# EAGLE design ProtoSnap-Pro_Mini (EAGLE 6.5.0)

## Sheet 1 of 2
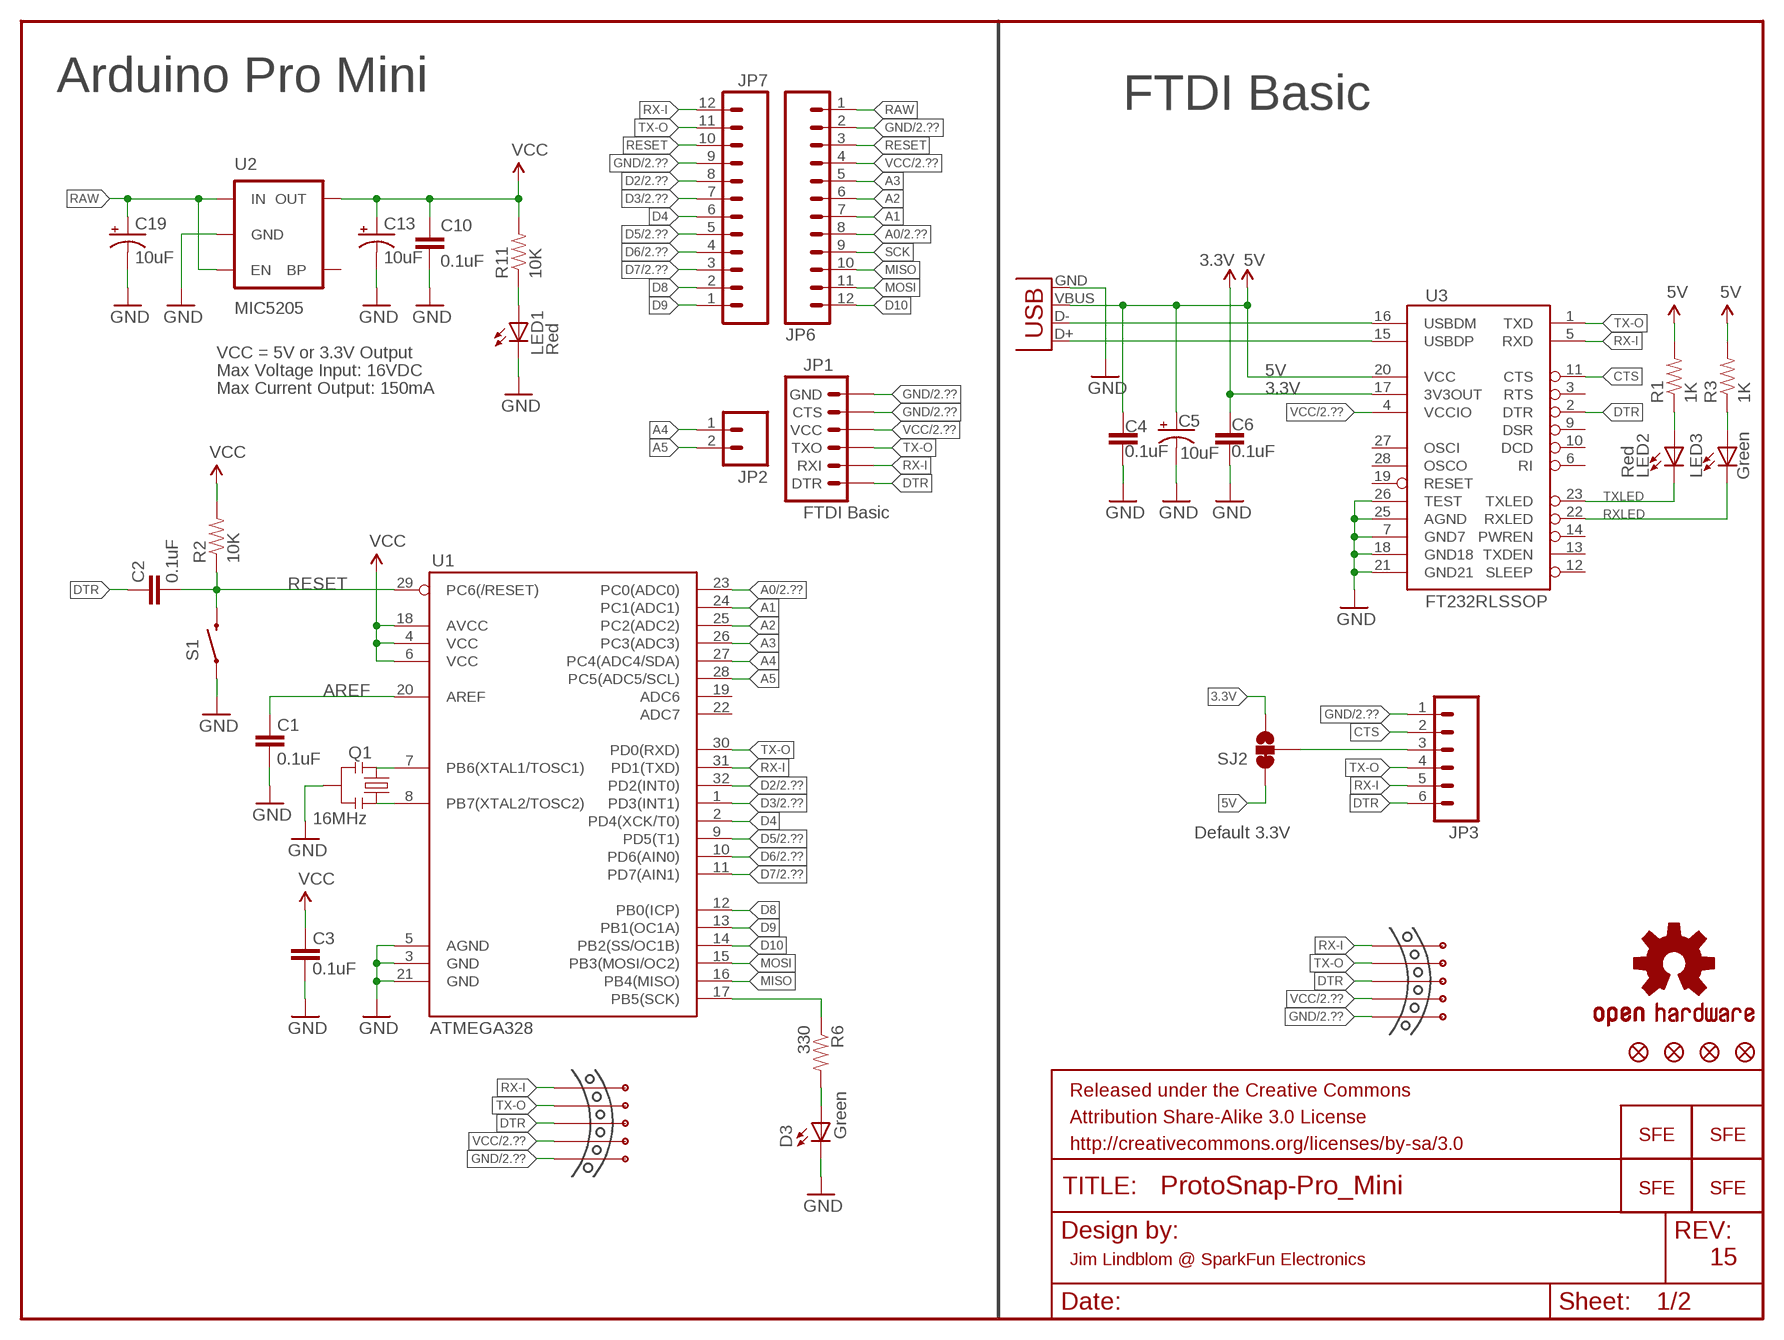
[diagram p0: schematic, sheet 1]

### Parts
C1  0.1uF  CAP0603-CAP  [0603-CAP]
C2  0.1uF  CAP0603-CAP  [0603-CAP]
C3  0.1uF  CAP0603-CAP  [0603-CAP]
C4  0.1uF  CAP0603-CAP  [0603-CAP]
C5  10uF  CAP_POL1206  [EIA3216]
C6  0.1uF  CAP0603-CAP  [0603-CAP]
C10  0.1uF  CAP0603-CAP  [0603-CAP]
C13  10uF  CAP_POL1206  [EIA3216]
C19  10uF  CAP_POL1206  [EIA3216]
D3  Green  LEDLED-ALT1  [0603-LED-ALT1]
FRAME1  FRAME-LETTER  [CREATIVE_COMMONS]
JP1  FTDI Basic  ARDUINO_SERIAL_PROGRAMPTH  [1X06]
JP2  M02PTH  [1X02]
JP3  M06SIP  [1X06]
JP4  LOGO-SFENW2  [SFE-NEW-WEB]
JP6  M12PTH  [1X12]
JP7  M12PTH  [1X12]
JP15  LOGO-SFESK  [SFE-LOGO-FLAME]
JP16  FIDUCIAL1X2.5  [FIDUCIAL-1X2.5]
JP17  LOGO-SFESK  [SFE-LOGO-FLAME]
JP18  LOGO-SFENEW  [SFE-NEW-WEBLOGO]
JP19  FIDUCIAL1X2.5  [FIDUCIAL-1X2.5]
JP20  FIDUCIAL1X2.5  [FIDUCIAL-1X2.5]
JP22  FIDUCIAL1X2.5  [FIDUCIAL-1X2.5]
LED1  Red  LEDLED-ALT1  [0603-LED-ALT1]
LED2  Red  LEDLED-ALT1  [0603-LED-ALT1]
LED3  Green  LEDLED-ALT1  [0603-LED-ALT1]
LOGO1  OSHW-LOGOS  [OSHW-LOGO-S]
Q1  16MHz  RESONATOR1:1  [RESONATOR-SMD-1:1]
R1  1K  RESISTOR0603-RES  [0603-RES]
R2  10K  RESISTOR0603-RES  [0603-RES]
R3  1K  RESISTOR0603-RES  [0603-RES]
R6  330  RESISTOR0603-RES  [0603-RES]
R11  10K  RESISTOR0603-RES  [0603-RES]
S1  SWITCH-MOMENTARY-2SMD-ALT01  [TACTILE-SWITCH-SMD-ALT01]
SJ2  SOLDERJUMPER_2WAYS  [SJ_3]
U1  ATMEGA328  ATMEGA168  [TQFP32-08]
U2  MIC5205  V_REG_LDOSMD  [SOT23-5]
U3  FT232RLSSOP  [SSOP28DB]
U$22  MOUSE-BITE-5  [MOUSE-BITE-5]
U$23  MOUSE-BITE-5  [MOUSE-BITE-5]
X2  USB-SMD-NS  [USB-MINIB-NOSTOP]

### Nets
3.3V [power]: C6.1 SJ2.3 U3.17(3V3OUT)
5V: C4.1 C5.A(+) R1.2 R3.2 SJ2.1 U3.20(VCC) X2.VBUS
A0: JP6.8 U1.23(PC0(ADC0)) ; also sheet 2
A1: JP6.7 U1.24(PC1(ADC1))
A2: JP6.6 U1.25(PC2(ADC2))
A3: JP6.5 U1.26(PC3(ADC3))
A4: JP2.1 U1.27(PC4(ADC4/SDA))
A5: JP2.2 U1.28(PC5(ADC5/SCL))
AREF: C1.2 U1.20(AREF)
CTS: JP3.2 U3.11(CTS)
D2: JP7.8 U1.32(PD2(INT0)) ; also sheet 2
D3: JP7.7 U1.1(PD3(INT1)) ; also sheet 2
D4: JP7.6 U1.2(PD4(XCK/T0))
D5: JP7.5 U1.9(PD5(T1)) ; also sheet 2
D6: JP7.4 U1.10(PD6(AIN0)) ; also sheet 2
D7: JP7.3 U1.11(PD7(AIN1)) ; also sheet 2
D8: JP7.2 U1.12(PB0(ICP))
D9: JP7.1 U1.13(PB1(OC1A))
D10: JP6.12 U1.14(PB2(SS/OC1B))
DTR: C2.2 JP1.1(DTR) JP3.6 U3.2(DTR) U$22.P$3 U$23.P$3
GND [power]: C1.1 C3.1 C4.2 C5.C(-) C6.2 C10.2 C13.C(-) C19.C(-) D3.C JP1.5(CTS) JP1.6(GND) JP3.1 JP6.2 JP7.9 LED1.C Q1.2 S1.1 S1.2 U1.3(GND) U1.5(AGND) U1.21(GND) U2.2(GND) U3.7(GND7) U3.18(GND18) U3.21(GND21) U3.25(AGND) U3.26(TEST) U$22.P$5 U$23.P$5 X2.GND ; also sheet 2
MISO: JP6.10 U1.16(PB4(MISO))
MOSI: JP6.11 U1.15(PB3(MOSI/OC2))
N$1: Q1.1 U1.8(PB7(XTAL2/TOSC2))
N$2: Q1.3 U1.7(PB6(XTAL1/TOSC1))
N$3: LED2.A R1.1
N$4: LED3.A R3.1
N$7: D3.A R6.2
N$38: LED1.A R11.1
RAW [power]: C19.A(+) JP6.1 U2.1(IN) U2.3(EN)
RESET: C2.1 JP6.3 JP7.10 R2.1 S1.3 S1.4 U1.29(PC6(/RESET))
RX-I: JP1.2(RXI) JP3.5 JP7.12 U1.31(PD1(TXD)) U3.5(RXD) U$22.P$1 U$23.P$1
RXLED: LED3.C U3.22(RXLED)
SCK: JP6.9 R6.1 U1.17(PB5(SCK))
TX-O: JP1.3(TXO) JP3.4 JP7.11 U1.30(PD0(RXD)) U3.1(TXD) U$22.P$2 U$23.P$2
TXLED: LED2.C U3.23(TXLED)
USB_D+: U3.15(USBDP) X2.D+
USB_D-: U3.16(USBDM) X2.D-
VCC: C3.2 C10.1 C13.A(+) JP1.4(VCC) JP3.3 JP6.4 R2.2 R11.2 SJ2.2 U1.4(VCC) U1.6(VCC) U1.18(AVCC) U2.5(OUT) U3.4(VCCIO) U$22.P$4 U$23.P$4 ; also sheet 2
Unconnected: U1.19(ADC6) U1.22(ADC7) U2.4(BP) U3.3(RTS) U3.6(RI) U3.9(DSR) U3.10(DCD) U3.12(SLEEP) U3.13(TXDEN) U3.14(PWREN) U3.19(RESET) U3.27(OSCI) U3.28(OSCO)

### Notes on the sheet
- Arduino Pro Mini
- FTDI Basic
- VCC = 5V or 3.3V Output
- Max Voltage Input: 16VDC
- Max Current Output: 150mA
- Default 3.3V
- Jim Lindblom @ SparkFun Electronics | 15

## Sheet 2 of 2
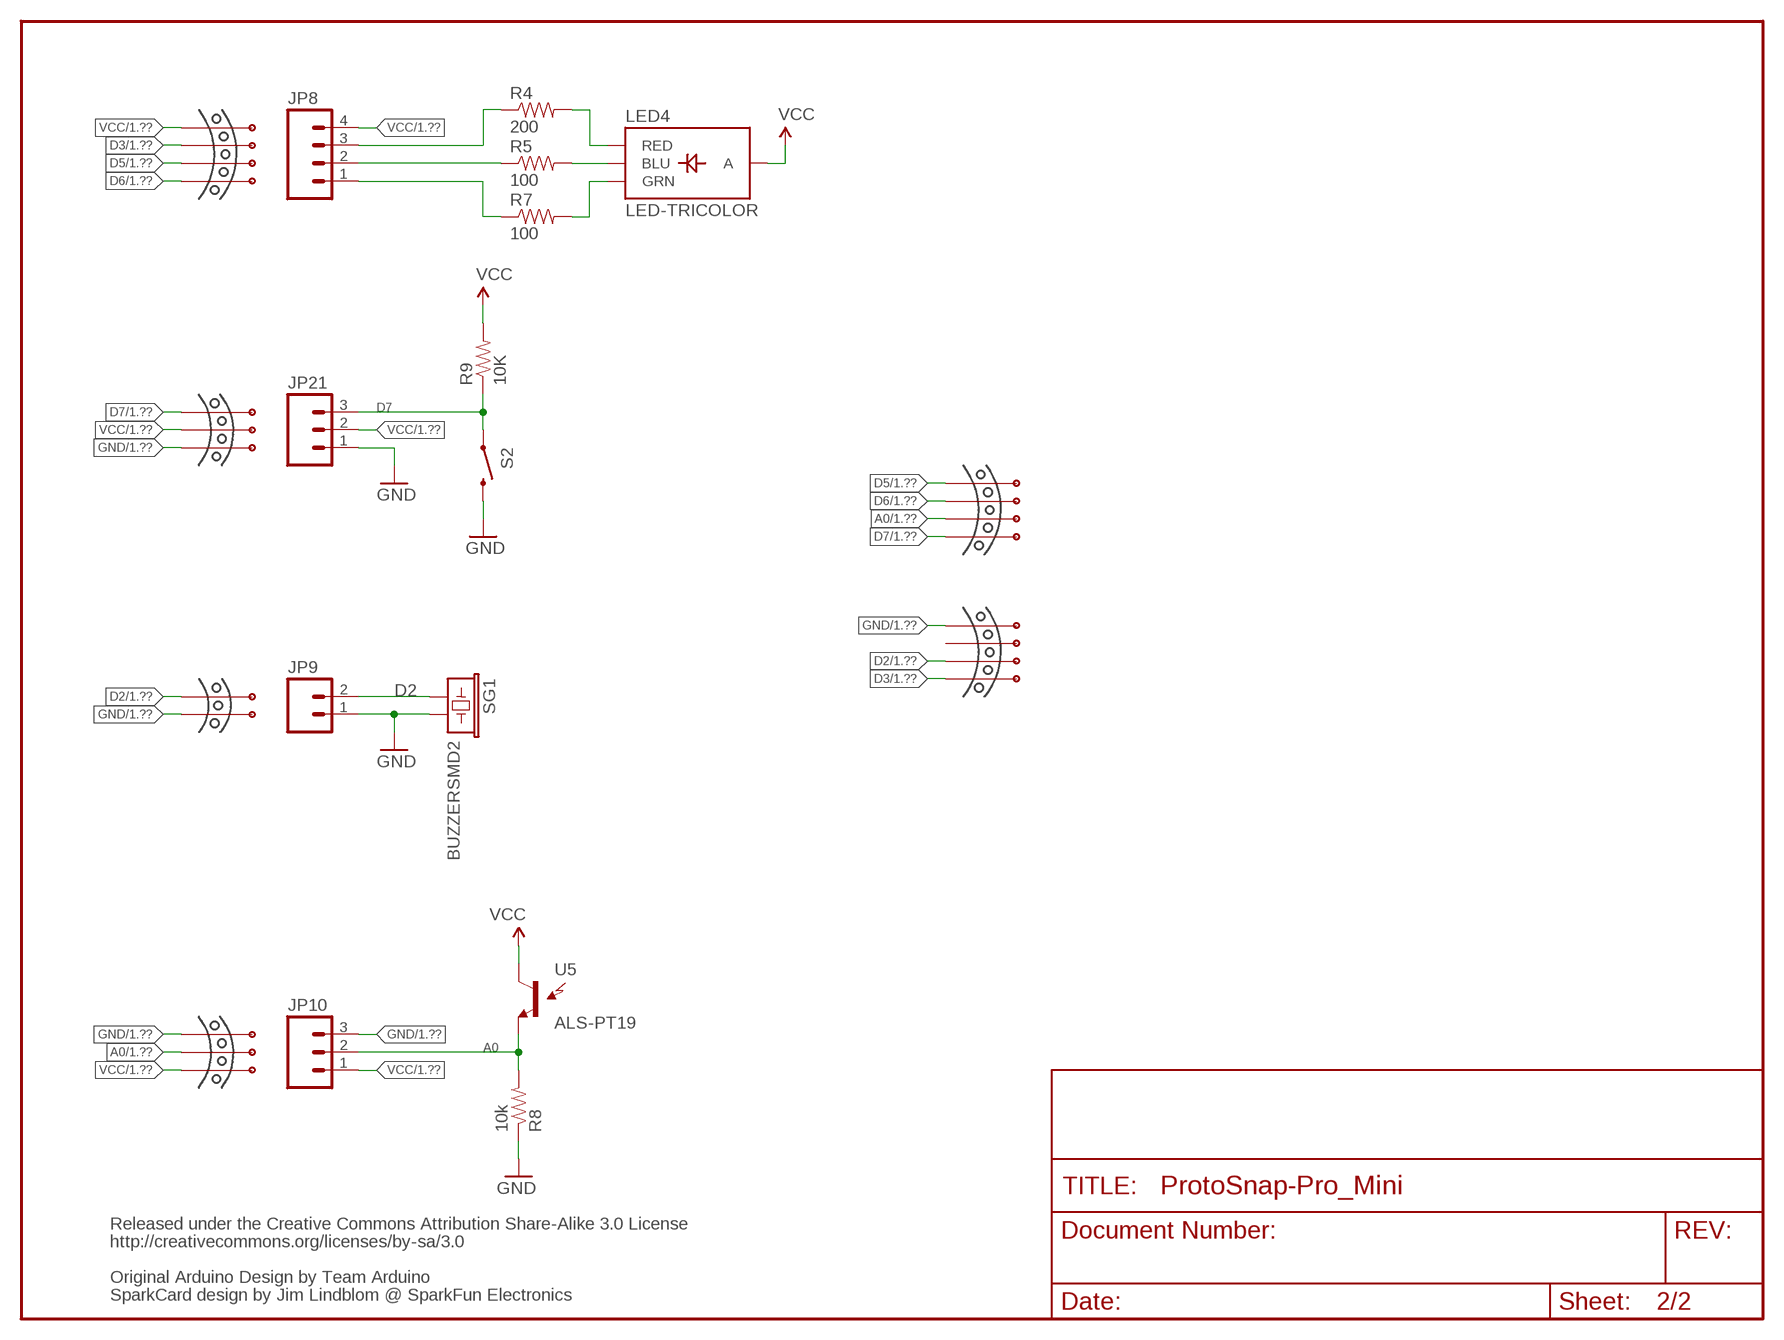
[diagram p1: schematic, sheet 2]

### Parts
JP8  M04PTH  [1X04]
JP9  M02PTH  [1X02]
JP10  M03PTH  [1X03]
JP21  M03PTH  [1X03]
LED4  LED-TRICOLOR  [LED-TRICOLOR-SMD]
R4  200  RESISTOR0603-RES  [0603-RES]
R5  100  RESISTOR0603-RES  [0603-RES]
R7  100  RESISTOR0603-RES  [0603-RES]
R8  10k  RESISTOR0603-RES  [0603-RES]
R9  10K  RESISTOR0603-RES  [0603-RES]
S2  SWITCH-MOMENTARY-2SMD-ALT01  [TACTILE-SWITCH-SMD-ALT01]
SG1  BUZZERSMD2  [BUZZER-CCV]
U5  ALS-PT19  LIGHTSENSORALS  [ALS-PT19]
U$2  MOUSE-BITE-3  [MOUSE-BITE-3]
U$7  MOUSE-BITE-2  [MOUSE-BITE-2]
U$8  MOUSE-BITE-4  [MOUSE-BITE-4]
U$9  MOUSE-BITE-3  [MOUSE-BITE-3]
U$13  MOUSE-BITE-4  [MOUSE-BITE-4]
U$14  MOUSE-BITE-4  [MOUSE-BITE-4]

### Nets
A0: JP10.2 R8.2 U5.E(E1) U$9.P$2 U$13.P$3 ; also sheet 1
D2: JP9.2 SG1.+ U$7.P$1 U$14.P$3 ; also sheet 1
D3: JP8.3 R4.1 U$8.P$2 U$14.P$4 ; also sheet 1
D5: JP8.1 R7.1 U$8.P$3 U$13.P$1 ; also sheet 1
D6: JP8.2 R5.1 U$8.P$4 U$13.P$2 ; also sheet 1
D7: JP21.3 R9.1 S2.1 S2.2 U$2.P$3 U$13.P$4 ; also sheet 1
GND [power]: JP9.1 JP10.3 JP21.1 R8.1 S2.3 S2.4 SG1.- U$2.P$1 U$7.P$2 U$9.P$3 U$14.P$1 ; also sheet 1
N$6: LED4.R(RED) R4.2
N$8: LED4.B(BLU) R5.2
N$9: LED4.G(GRN) R7.2
VCC: JP8.4 JP10.1 JP21.2 LED4.A R9.2 U5.C(C1) U$2.P$2 U$8.P$1 U$9.P$1 ; also sheet 1
Unconnected: U$14.P$2

### Notes on the sheet
- Released under the Creative Commons Attribution Share-Alike 3.0 License
- http://creativecommons.org/licenses/by-sa/3.0
- Original Arduino Design by Team Arduino
- SparkCard design by Jim Lindblom @ SparkFun Electronics

## Library data of the parts
C1-C4 C6 C10 = SparkFun:CAP: Capacitor Standard 0603 ceramic capacitor, and 0.1" leaded capacitor.
C5 C13 C19 = SparkFun:CAP_POL: Capacitor Polarized These are standard SMD and PTH capacitors. Normally 10uF, 47uF, and 100uF in electrolytic and tantalum varieties. Always verify the external diameter of the through hole cap, it varies with capacity, voltage, and manufacturer. The EIA devices should be standard.
D3 LED1-LED3 = Testing:LED: LEDs Standard schematic elements and footprints for 5mm, 3mm, 1206, and 0603 sized LEDs. 5mm - Spark Fun Electronics SKU : COM-00529 (and others)
FRAME1 = SparkFun-Aesthetics:FRAME-LETTER: Schematic Frame Standard 8.5x11 US Letter frame
JP1 = SparkFun:ARDUINO_SERIAL_PROGRAM
JP2 JP9 = SparkFun:M02: Header 2 Standard 2-pin 0.1" header. Use with straight break away headers (SKU : PRT-00116), right angle break away headers (PRT-00553), swiss pins (PRT-00743), machine pins (PRT-00117), and female headers (PRT-00115). Molex polarized connector foot print use with SKU : PRT-08233 with associated crimp pins and housings.
JP3 = SparkFun:M06: Header 6 Standard 6-pin 0.1" header. Use with straight break away headers (SKU : PRT-00116), right angle break away headers (PRT-00553), swiss pins (PRT-00743), machine pins (PRT-00117), and female headers (PRT-00115). Molex polarized connector foot print use with SKU : PRT-08094 with associated crimp pins and housings. NOTES ON THE VARIANTS LOCK and LOCK_LONGPADS... This footprint was designed to help hold the alignment of a through-hole component (i.e. 6-pin header) while soldering it into place. You may notice that each hole has been shifted either up or down by 0.005 of an inch from it's more standard position (which is a perfectly straight line). This slight alteration caused the pins (the squares in the middle) to touch the edges of the holes. Because they are alternating, it causes a "brace" to hold the component in place. 0.005 has proven to be the perfect amount of "off-center" position when using our standard breakaway headers. Although looks a little odd when you look at the bare footprint, once you have a header in there, the alteration is very hard to notice. Also, if you push a header all the way into place, it is covered up entirely on the bottom side. This idea of altering the position of holes to aid alignment will be further integrated into the Sparkfun Library for other footprints. It can help hold any component with 3 or more connection pins.
JP4 JP15 JP17 JP18 = SparkFun:LOGO-SFE: Spark Fun Electronics PCB Logo This is the standard Spark Fun Electronics PCB logo.
JP6 JP7 = SparkFun:M12: Header 12 Standard 12-pin 0.1" header. Use with straight break away headers (SKU : PRT-00116), right angle break away headers (PRT-00553), swiss pins (PRT-00743), machine pins (PRT-00117), and female headers (PRT-00115).
JP8 = SparkFun:M04: Header 4 Standard 4-pin 0.1" header. Use with straight break away headers (SKU : PRT-00116), right angle break away headers (PRT-00553), swiss pins (PRT-00743), machine pins (PRT-00117), and female headers (PRT-00115). Molex polarized connector foot print use with SKU : PRT-08231 with associated crimp pins and housings. 1MM SMD Version SKU: PRT-10208
JP10 JP21 = SparkFun:M03: Header 3 Standard 3-pin 0.1" header. Use with straight break away headers (SKU : PRT-00116), right angle break away headers (PRT-00553), swiss pins (PRT-00743), machine pins (PRT-00117), and female headers (PRT-00115). Molex polarized connector foot print use with SKU : PRT-08232 with associated crimp pins and housings.
JP16 JP19 JP20 JP22 = abes:FIDUCIAL: Fiducial Alignment Points Various fiducial points for machine vision alignment.
LED4 = SparkFun:LED-TRICOLOR: Tri-Color LED SMD Proven layout and schematic for triple color LED in SMD package - common anode. Spark Fun Electronics SKU : COM-07844
LOGO1 = SparkFun-Aesthetics:OSHW-LOGO: Open Source Hardware Logo This logo indicates the piece of hardware it is found on incorporates a OSHW license and/or adheres to the definition of open source hardware found here: http://freedomdefined.org/OSHW
Q1 = Testing:RESONATOR: Resonator Small SMD resonator. This is the itty bitty 10/20MHz resonators with built in caps. CSTCE10M0G55 and CSTCE20M0V53. Footprint for SMD has been used in SFE production for years, and does work okay. 1:1 is an attempt to get larger fillets on the sides so it will be easier to inspect these solders in our AOI machine. The pads have been minimized to match the actual metal under the resonator. To see this relation, it includes an image import of the bottom side of the component. Imported to scale on layer 200.
R1-R9 R11 = SparkFun:RESISTOR: Resistor Basic schematic elements and footprints for 0603, 1206, and PTH resistors.
S1 S2 = Testing:SWITCH-MOMENTARY-2: Various NO switches- pushbuttons, reed, etc
SG1 = SparkFun:BUZZER: Buzzer 12mm Spark Fun Electronics SKU : Comp-Buzzer
SJ2 = SparkFun:SOLDERJUMPER_2WAY: Solder Jumper 2 way solder jumper
U1 = SparkFun:ATMEGA168
U2 = SparkFun:V_REG_LDO: Voltage Regulator LDO Standard 150mA LDO voltage regulator in SOT-23 layout. Micrel part MIC5205. BP (by-pass) pin is used to lower output noise with 470pF cap.
U3 = SparkFun:FT232RL: USB UART FT232RL 4th Generation USB UART (USB <-> Serial) Controller. Spark Fun Electronics SKU : COM-00650
U5 = SparkFun-Sensors:LIGHTSENSOR: Ambient Light Sensor Simple light detection sensor. Output varies with light intensity input. Spark Fun Electronics SKU : COM-08348; PROD_ID: IC-11836
U$2 U$9 = SparkFun:MOUSE-BITE-3
U$7 = SparkFun:MOUSE-BITE-2
U$8 U$13 U$14 = SparkFun:MOUSE-BITE-4
U$22 U$23 = SparkFun:MOUSE-BITE-5
X2 = SparkFun:USB: USB Connectors USB-B-PTH is fully proven SKU : PRT-00139 USB-miniB is fully proven SKU : PRT-00587 USB-A-PCB is untested. USB-A-H is throughly reviewed, but untested. Spark Fun Electronics SKU : PRT-00437 USB-B-SMT is throughly reviewed, but untested. Needs silkscreen touching up. USB-A-S has not been used/tested USB-MB-H has not been used/tested

## Net classes
0 default: width 0.203 mm
1 power: width 0.254 mm

## Board
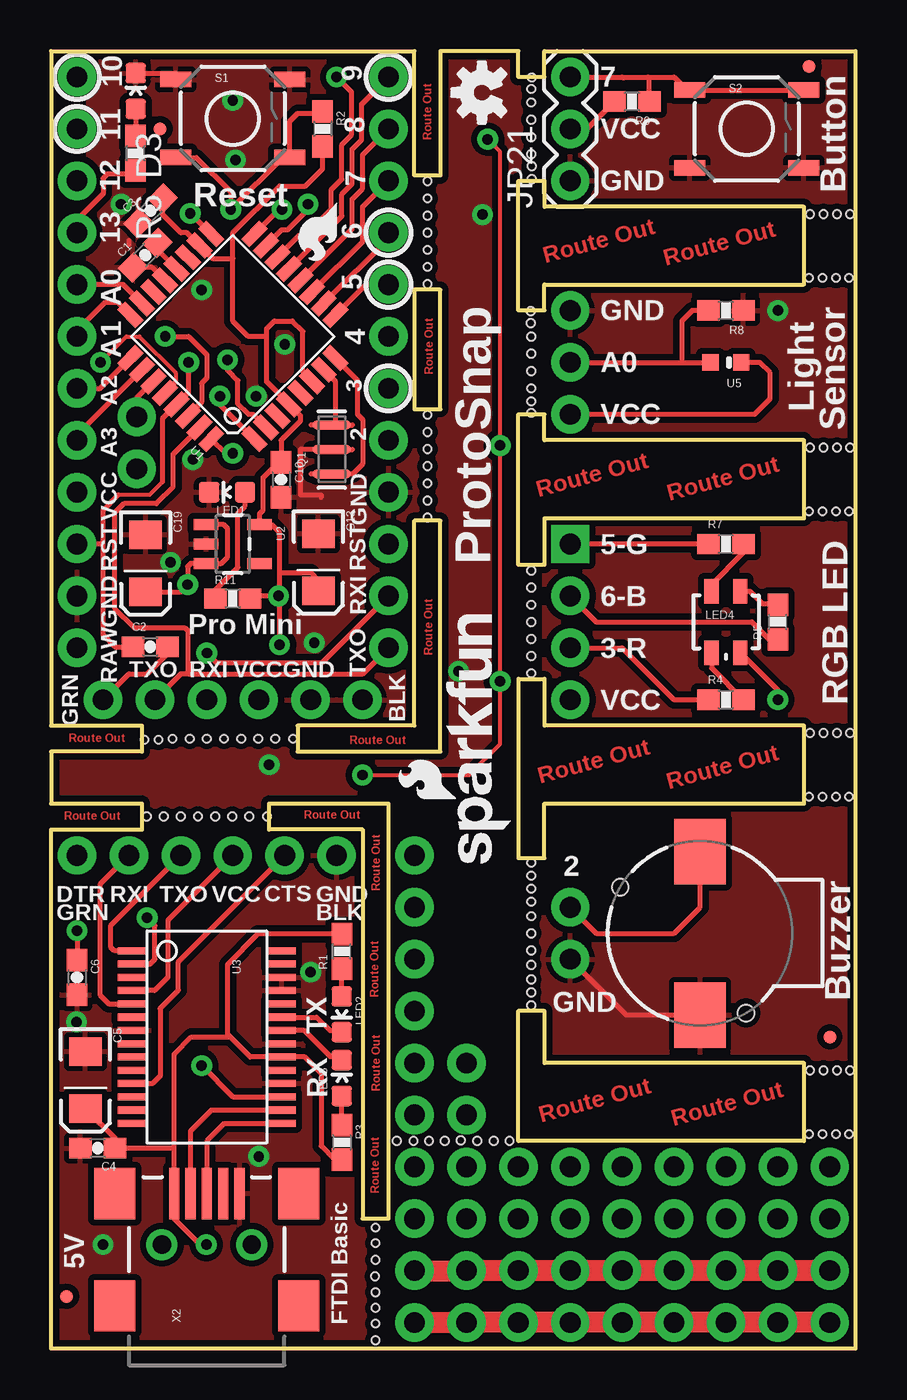
[diagram p2: board, top side]
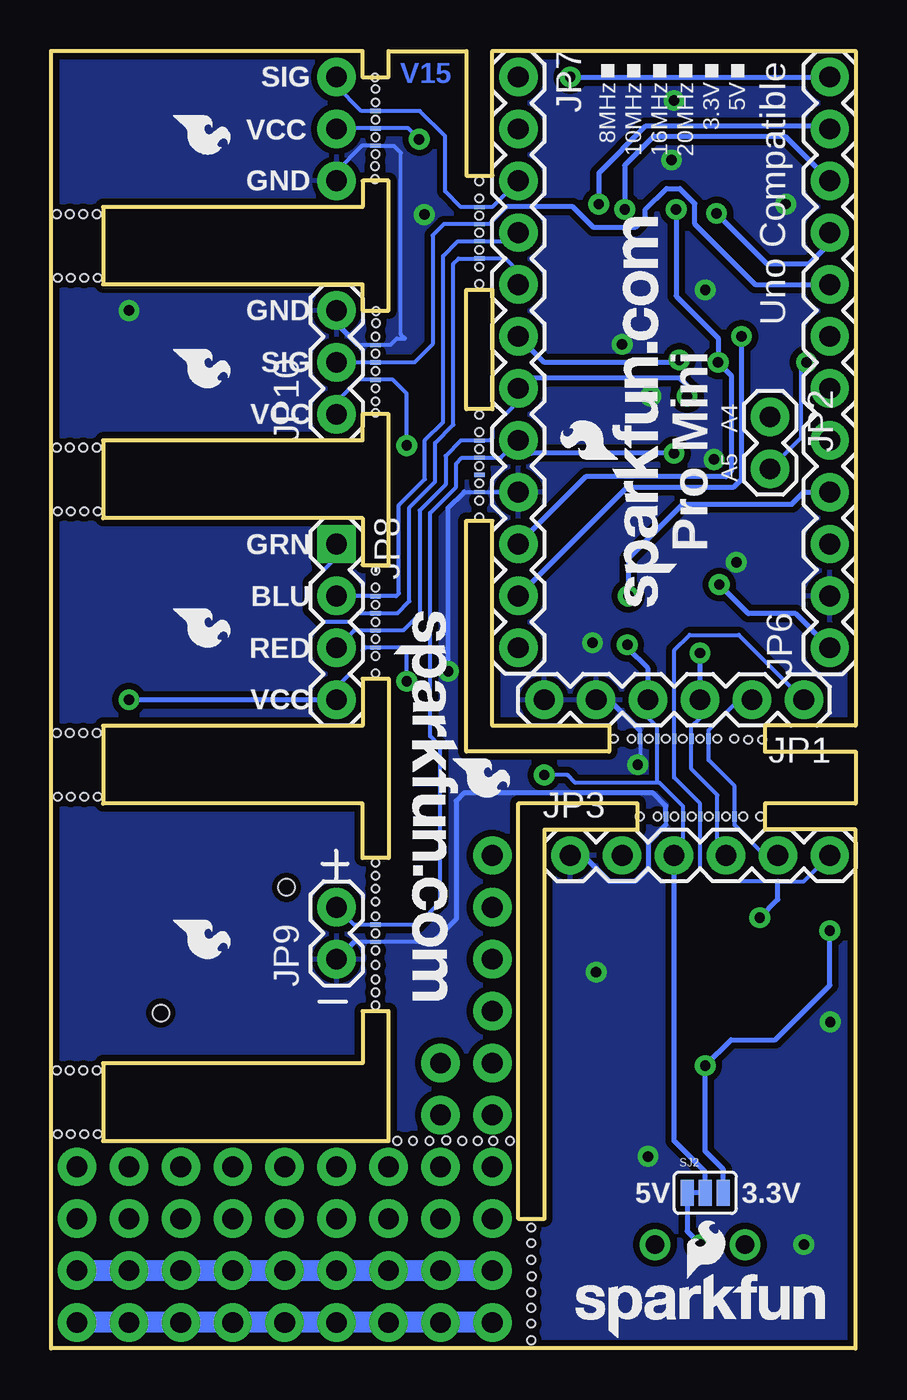
[diagram p3: board, bottom side, seen from below]

Size 39.37 x 63.5 mm. Coordinates in mm from the lower left corner, seen from the top.
Outline: 36.83,13.97 24.13,13.97 24.13,16.51 22.86,16.51 22.86,10.16 36.83,10.16 36.83,13.97
Outline: 24.13,26.67 36.83,26.67 36.83,30.48 24.13,30.48 24.13,32.77 22.86,32.77 22.86,24 24.13,24 24.13,26.67
Outline: 24.13,40.64 36.83,40.64 36.83,44.45 24.13,44.45 24.13,45.72 22.86,45.72 22.86,38.35 24.13,38.35 24.13,40.64
Outline: 36.83,55.88 24.13,55.88 24.13,57.15 22.86,57.15 22.86,50.8 24.13,50.8 24.13,52.07 36.83,52.07 36.83,55.88
Outline: 24.13,63.5 39.37,63.5 39.37,0 0,0 0,25.4 4.45,25.4 4.45,26.67 0,26.67 0,29.21 4.45,29.21 4.45,30.48 0,30.48 0,63.5 17.78,63.5 17.78,57.4 19.05,57.4 19.05,63.5 22.86,63.5 22.86,62.23 24.13,62.23 24.13,63.5
Outline: 17.78,30.48 17.78,40.51 19.05,40.51 19.05,29.21 12.06,29.21 12.06,30.48 17.78,30.48
Outline: 15.24,25.4 15.24,6.35 16.51,6.35 16.51,26.67 10.67,26.67 10.67,25.4 15.24,25.4
Outline: 17.78,45.97 19.05,45.97 19.05,51.82 17.78,51.82 17.78,45.97
Copper layers (1*16): Top 0.035mm / dielectric 1.5mm / Bottom 0.035mm
Design rules "SparkFun *": minimum track width 8mil, minimum drill 20mil, track to track 8mil, track to pad 8mil, pad to pad 8mil, via to via 8mil, smd to smd 8mil, copper to edge 8mil, drill to drill 8mil, minimum pad ring 12mil, minimum via ring 10mil, stop-mask expansion 4mil, vias tented up to drill 20mil, thermal gap 10mil
Holes 0.38 mm at 19.25,10.16 20.85,10.16 21.67,10.16 20.04,10.19 22.43,10.16 5.26,29.79 4.57,29.79 16.92,10.16 17.73,10.16 18.49,10.16 15.88,2.74 15.88,4.34 15.88,5.16 15.85,3.53 15.88,5.92 15.88,0.41 15.88,1.22 15.88,1.98 23.5,18.77 23.5,18.06 23.5,22.5 23.5,21.87 23.5,46.35 23.5,45.8 23.47,50.19 23.47,50.77 23.52,57.86 23.52,57.23 23.5,61.65 23.52,62.2 23.5,23.77 23.5,23.14 23.5,17.42 23.5,16.79 37.8,55.52 38.46,55.52 39.09,55.52 37.13,55.52 37.74,52.4 38.4,52.4 39.04,52.4 37.08,52.4 37.8,44.09 38.46,44.09 39.09,44.09 37.13,44.09 37.74,40.97 38.4,40.97 39.04,40.97 37.08,40.97 37.8,30.12 38.46,30.12 39.09,30.12 37.13,30.12 37.74,27 38.4,27 39.04,27 37.08,27 37.8,13.61 38.46,13.61 39.09,13.61 37.13,13.61 37.74,10.49 38.4,10.49 39.04,10.49 37.08,10.49

### Footprints (pad centres in the part's own frame; a part is rotated, then mirrored left to right if it is on the bottom)
0603-CAP = smd 1.1 x 1: 1 -0.85,0; 2 0.85,0
EIA3216 = smd 1.4 x 1.6: A 1.4,0; C -1.4,0
0603-LED-ALT1 = smd 1 x 1: A 0,-0.877; C 0,0.877
1X06 = drill 1.016 pad 1.88: 1 0,0; 2 2.54,0; 3 5.08,0; 4 7.62,0; 5 10.16,0; 6 12.7,0
1X02 = drill 1.016 pad 1.88: 1 0,0; 2 2.54,0
1X12 = drill 1.016 pad 1.88: 1 0,0; 2 2.54,0; 3 5.08,0; 4 7.62,0; 5 10.16,0; 6 12.7,0; 7 15.24,0; 8 17.78,0; 9 20.32,0; 10 22.86,0; 11 25.4,0; 12 27.94,0
1X04 = drill 1.016 pad 1.88 square: 1 0,0 | drill 1.016 pad 1.88: 2 2.54,0; 3 5.08,0; 4 7.62,0
1X03 = drill 1.016 pad 1.88: 1 0,0; 2 2.54,0; 3 5.08,0
FIDUCIAL-1X2.5 = smd 0.635 x 0.635: 1 0,0
LED-TRICOLOR-SMD = smd 0.7 x 1.2: A 0.7,-1.5; B 0.7,1.5; G -0.7,1.5; R -0.7,-1.5
RESONATOR-SMD-1:1 = smd 0.45 x 1.905: 1 -1.2,0; 2 0,0; 3 1.2,0
0603-RES = smd 1.1 x 1: 1 -0.85,0; 2 0.85,0
TACTILE-SWITCH-SMD-ALT01 = smd 1.524 x 0.762: 1 -2.794,1.905; 2 2.794,1.905; 3 -2.794,-1.905; 4 2.794,-1.905
BUZZER-CCV = smd 3.2 x 2.5: + 4,0; - -4,0 | hole 0.8: -3.9,-2.25; 2.25,3.9
SJ_3 = smd 0.635 x 1.27: 1 -0.889,0; 2 0,0; 3 0.889,0
TQFP32-08 = smd 1.27 x 0.559: 1 -4.293,2.8; 2 -4.293,2; 3 -4.293,1.2; 4 -4.293,0.4; 5 -4.293,-0.4; 6 -4.293,-1.2; 7 -4.293,-2; 8 -4.293,-2.8; 17 4.293,-2.8; 18 4.293,-2; 19 4.293,-1.2; 20 4.293,-0.4; 21 4.293,0.4; 22 4.293,1.2; 23 4.293,2; 24 4.293,2.8 | smd 0.559 x 1.27: 9 -2.8,-4.293; 10 -2,-4.293; 11 -1.2,-4.293; 12 -0.4,-4.293; 13 0.4,-4.293; 14 1.2,-4.293; 15 2,-4.293; 16 2.8,-4.293; 25 2.8,4.293; 26 2,4.293; 27 1.2,4.293; 28 0.4,4.293; 29 -0.4,4.293; 30 -1.2,4.293; 31 -2,4.293; 32 -2.8,4.293
SOT23-5 = smd 0.55 x 1.2: 1 -0.95,-1.3; 2 0,-1.3; 3 0.95,-1.3; 4 0.95,1.3; 5 -0.95,1.3
SSOP28DB = smd 0.348 x 1.397: 1 -4.225,-3.656; 2 -3.575,-3.656; 3 -2.925,-3.656; 4 -2.275,-3.656; 5 -1.625,-3.656; 6 -0.975,-3.656; 7 -0.325,-3.656; 8 0.325,-3.656; 9 0.975,-3.656; 10 1.625,-3.656; 11 2.275,-3.656; 12 2.925,-3.656; 13 3.575,-3.656; 14 4.225,-3.656; 15 4.225,3.656; 16 3.575,3.656; 17 2.925,3.656; 18 2.275,3.656; 19 1.625,3.656; 20 0.975,3.656; 21 0.325,3.656; 22 -0.325,3.656; 23 -0.975,3.656; 24 -1.625,3.656; 25 -2.275,3.656; 26 -2.925,3.656; 27 -3.575,3.656; 28 -4.225,3.656
ALS-PT19 = smd 0.8 x 0.8: C -0.75,0; E 0.75,0
MOUSE-BITE-3 = smd 0.203 x 0.508 bottom: P$1 -0.851,0; P$2 0,0; P$3 0.851,0 | hole 0.381: -1.27,0; -0.432,0; 0.432,0; 1.27,0
MOUSE-BITE-2 = smd 0.203 x 0.508 bottom: P$1 -0.419,0; P$2 0.419,0 | hole 0.381: -0.838,0; 0,0; 0.838,0
MOUSE-BITE-4 = smd 0.203 x 0.508 bottom: P$1 -1.257,0; P$2 -0.419,0; P$3 0.419,0; P$4 1.257,0 | hole 0.381: -1.676,0; -0.838,0; 0,0; 0.838,0; 1.676,0; 2.515,0; -2.515,0
MOUSE-BITE-5 = smd 0.203 x 0.508 bottom: P$1 -1.689,0; P$2 -0.851,0; P$3 -0.013,0; P$4 0.826,0; P$5 1.664,0 | hole 0.381: -2.108,0; -1.27,0; -0.432,0; 0.406,0; 1.245,0; 2.083,0; -2.946,0; 2.946,0
USB-MINIB-NOSTOP = smd 2.5 x 0.5: D+ 2.5,0; D- 2.5,0.8; GND 2.5,-1.6; ID 2.5,-0.8; VBUS 2.5,1.6 | smd 2.5 x 2: G1 -3,-4.5; G2 -3,4.5; G3 2.5,4.5; G4 2.5,-4.5 | drill 0.9 pad 0.8: H1 0,2.2 | drill 0.9 pad 0.787: H2 0,-2.2

### Placement (x,y rotation side)
C1  4.6,53.52 45 top
C2  4.85,34.34 0 top
C3  4.86,55.69 45 top
C4  2.29,9.8 180 top
C5  1.68,13.13 270 top
C6  1.27,18.16 270 top
C10  11.25,42.52 270 top
C13  13.08,38.48 270 top
C19  4.62,38.43 270 top
D3  4.14,61.54 0 top
FRAME1  -11.96,-10.16 0 top  (outside the outline)
JP1  2.54,31.75 180 bottom
JP2  4.19,45.59 270 bottom
JP3  13.97,24.13 0 bottom
JP4  13.72,0.51 0 bottom
JP5  LOGO-SFESK  [SFE-LOGO-FLAME]  8.26,3.43 0 bottom
JP6  1.27,34.29 90 bottom
JP7  16.51,62.23 270 bottom
JP8  25.4,39.37 270 bottom
JP9  25.4,19.05 90 bottom
JP10  25.4,45.72 90 bottom
JP11  LOGO-SFESK  [SFE-LOGO-FLAME]  33.4,20.95 270 bottom
JP12  LOGO-SFENW2  [SFE-NEW-WEB]  22.48,23.75 90 top
JP13  LOGO-SFESK  [SFE-LOGO-FLAME]  33.4,36.2 270 bottom
JP14  LOGO-SFESK  [SFE-LOGO-FLAME]  33.4,60.33 270 bottom
JP15  33.4,48.9 270 bottom
JP16  0.76,2.54 0 top
JP17  19.81,26.92 90 top
JP18  22.61,36.07 270 bottom
JP19  5.33,59.69 0 top
JP20  38.1,15.24 0 top
JP21  25.4,57.15 90 top
JP22  37.08,62.74 0 top
LED1  8.61,41.91 90 top
LED2  14.22,16.36 180 top
LED3  14.22,13.23 0 top
LED4  33.02,35.56 0 top
LOGO1  21.08,61.47 90 top
Q1  13.73,44 90 top
R1  14.22,19.43 90 top
R2  13.28,59.69 270 top
R3  14.22,10.08 270 top
R4  33.02,31.75 0 top
R5  35.56,35.56 90 top
R6  4.14,58.5 90 top
R7  33.02,39.37 0 top
R8  33.02,50.8 180 top
R9  28.42,61.04 180 top
R11  8.89,36.7 0 top
S1  8.89,60.2 0 top
S2  34.04,59.69 0 top
SG1  31.75,20.32 90 top
SJ2  7.37,7.62 0 bottom
U1  8.89,49.53 135 top
U2  8.89,39.37 270 top
U3  7.62,15.24 270 top
U5  33.02,48.26 180 top
U$1  LOGO-SFESK  [SFE-LOGO-FLAME]  13.97,56.06 180 top
U$2  23.5,59.72 90 top
U$7  23.5,20.32 270 top
U$8  23.5,35.56 90 top
U$9  23.5,48.26 90 top
U$11  LOGO-SFENEW  [SFE-NEW-WEBLOGO]  8.76,36.32 90 bottom
U$13  18.41,54.61 90 top
U$14  18.41,43.18 90 top
U$22  8.89,29.84 0 top
U$23  7.62,26.04 0 top
X2  7.62,5.08 90 top

### Tracks (layer width: path | path; a pad name or v marks a point on that pad's centre or on a via)
3.3V  (via drill 0.51)
  Top 0.254: U3.17 8.89,12.31 v7.37,13.84 | v1.27,20.45 C6.1
  Bottom 0.254: SJ2.3 6.48,8.76 7.37,9.65 v7.37,13.84 6.1,15.11 3.94,15.11 1.27,17.78 v1.27,20.45
5V  (via drill 0.51)
  Top 0.254: 8.76,15.24 9.74,14.27 U3.20 12.4,14.27 13.21,13.46 13.21,9.91 13.88,9.23 R3.2 | 8.76,15.24 8.64,15.37 8.64,18.8 10.12,20.28 R1.2 | 6.02,7.62 X2.VBUS | X2.VBUS 6.02,6.35 7.29,5.08 v7.59,5.08 | 6.02,9.8 C4.1 3.14,10.27 C5.A | X2.VBUS 6.02,9.8 | 6.02,9.8 6.02,14.4 6.86,15.24 8.76,15.24
  Bottom 0.254: SJ2.1 8.26,5.74 v7.59,5.08
A0
  Top 0.254: JP10.2 30.86,48.26 | 30.86,48.26 U5.E | U1.23 3.52,52.07 JP6.8 | R8.2 31.37,50.8 30.86,50.29 30.86,48.26
  Bottom 0.203: JP10.2 U$9.P$2 21.59,48.26 20.7,49.15 20.7,54.48 20.16,55.03 U$13.P$3 17.93,55.03 17.08,55.88
  Bottom 0.254: 17.08,55.88 13.84,55.88 12.83,54.86 10.79,54.86 10.29,55.37 10.29,55.75 9.27,56.77 8.61,56.77 7.87,56.03 7.87,55.02 4.93,52.07 JP6.8
A1
  Top 0.254: U1.24 3.28,51.18 2.62,51.18 1.27,49.84 JP6.7
A2
  Top 0.254: U1.25 2.39,46.99 JP6.6
A3
  Top 0.254: 1.27,44.74 JP6.5 1.27,44.74 | U1.26 1.27,44.74
A4
  Top 0.254: JP2.1 4.19,46.53 | 4.19,46.53 | 4.19,46.53 U1.27
A5  (via drill 0.51)
  Top 0.203: 6.1,47.3 6.1,47.75 4.32,49.53 3.68,49.53 v2.41,48.26
  Top 0.254: 6.1,47.3 | 6.1,47.3 U1.28
  Bottom 0.203: v2.41,48.26 2.67,48.01 2.67,44.58 JP2.2
AREF
  Top 0.254: U1.20 5.21,53.78 C1.2
CTS
  Top 0.254: U3.11 4.96,12.96 5.33,13.34 5.33,16.64 6.22,17.53 6.22,18.92 JP3.2
D2  (via drill 0.51)
  Top 0.254: SG1.+ 31.75,21.59 30.48,20.32 26.67,20.32 JP9.2 | U1.32 8.53,43.81 v8.89,43.81
  Bottom 0.203: JP9.2 24.55,20.74 U$7.P$1 21.43,20.74 20.32,21.84 20.32,29.46 20.83,29.97 20.83,40.89 19.56,42.16 19.56,43.31 19.27,43.6 U$14.P$3 17.36,43.6 JP7.8
  Bottom 0.254: v8.89,43.81 15.88,43.81 JP7.8
D3  (via drill 0.51)
  Top 0.254: JP8.3 27.94,34.29 30.48,31.75 R4.1 | 8.26,46.2 v8.26,46.61 8.26,46.2 | U1.1 8.26,46.2
  Bottom 0.203: JP8.3 24.55,35.14 U$8.P$2 22.14,35.14 21.34,35.94 21.34,41.02 20.07,42.29 20.07,43.69 19.32,44.44 U$14.P$4 17.92,44.44 17.78,44.58 17.78,45.09 16.51,46.35 JP7.7
  Bottom 0.254: v8.26,46.61 8.26,47.12 8.64,47.5 16,47.5 JP7.7
D4  (via drill 0.51)
  Top 0.254: v8.64,48.39 8.64,47.88 9.14,47.37 9.14,46.23 9.65,45.72 9.87,45.72 U1.2
  Bottom 0.254: JP7.6 15.24,48.26 8.76,48.26 v8.64,48.39
D5
  Top 0.254: U1.9 15.39,52.07 JP7.5 | R7.1 JP8.1
  Bottom 0.203: JP8.1 25.4,38.73 26.67,37.47 26.67,36.2 26.04,35.56 24.77,35.56 24.35,35.98 U$8.P$3 22.44,35.98 21.84,36.58 21.84,41.15 20.57,42.42 20.57,44.32 19.68,45.21 19.68,53.09 19.43,53.34 18.43,53.34 U$13.P$1 17.16,53.35 16.51,52.7 JP7.5
D6
  Top 0.254: JP7.4 16.51,54.32 U1.10 | JP8.2 26.67,35.56 34.29,35.56 35.14,34.71 R5.1
  Bottom 0.203: JP8.2 25.39,36.82 U$8.P$4 22.49,36.82 22.35,36.96 22.35,41.27 21.08,42.55 21.08,44.45 20.19,45.34 20.19,53.47 19.47,54.19 U$13.P$2 16.93,54.19 JP7.4 16.82,54.3
D7
  Top 0.203: 27.94,62.23 28,62.17
  Top 0.254: 15.24,54.18 15.24,55.88 JP7.3 | JP21.3 27.94,62.23 29.21,62.23 | 29.21,62.23 30.48,62.23 31.11,61.59 S2.1 S2.2 | 15.24,54.18 | 15.24,54.18 U1.11 | R9.1 29.27,62.17 29.21,62.23
  Bottom 0.203: JP7.3 17.79,55.87 U$13.P$4 19.32,55.87 20.09,56.64 20.09,59.33 21.32,60.57 U$2.P$3 24.19,60.57 25.4,61.77 JP21.3
D8
  Top 0.254: JP7.2 15.24,58.42 15.24,56.77 14.73,56.26 14.73,54.81 | 14.73,54.81 | 14.73,54.81 U1.12
D9
  Top 0.254: JP7.1 15.19,60.91 15.19,59.16 14.73,58.7 14.73,57 14.22,56.49 14.22,55.43 U1.13
D10  (via drill 0.51)
  Top 0.254: v13.97,62.23 14.71,61.49 14.71,59.41 14.22,58.93 14.22,57.23 13.72,56.72 13.72,55.75 12.45,54.48 12.15,54.48 U1.14
  Bottom 0.254: v13.97,62.23 JP6.12
DTR  (via drill 0.51)
  Top 0.254: JP1.1 3.81,33.02 4.7,33.02 5.7,34.02 C2.2 | U3.2 4.84,18.82 5.08,19.05 5.08,20.7 v4.7,21.08
  Bottom 0.203: JP3.6 2.54,22.86 3.81,22.86 6.99,22.86 7.61,23.48 U$23.P$3 7.62,26.67 8.89,27.94 8.88,27.95 U$22.P$3 8.88,34.18 8.13,34.92 5.71,34.92 JP1.1
  Bottom 0.254: v4.7,21.08 3.81,21.97 3.81,22.86
GND  (via drill 0.51)
  Top 0.254: 3.81,54.23 3.81,54.04 | SG1.- 28.13,16.32 JP9.1 | U1.21 4.94,52.91 C1.1 | 13.21,41.66 13.21,41.78 12.19,41.78 12.19,44.01 12.72,44.01 | D3.C 6.1,62.42 S1.1
  Bottom 0.203: U$23.P$5 9.28,26.45 | 10.55,30.24 U$22.P$5 10.55,28.69 | U$23.P$5 9.28,25.64 | 24.55,19.9 U$7.P$2 20.66,19.9 | 24.35,49.11 U$9.P$3 22.77,49.11 22.45,49.43 22.05,49.43 22.25,49.63 22.25,58.52 22.58,58.85 U$2.P$1 24.17,58.86 25.4,57.63 JP21.1 | 19.16,41.92 U$14.P$1 16.52,41.92 JP7.9 | U$23.P$5 9.3,26.05
  Bottom 0.254: 9.28,25.64 10.16,24.77 10.16,23.5 10.79,22.86 12.06,22.86 13.34,24.13 JP3.1 | 20.66,19.9 19.56,21.01 19.56,26.8 19.18,27.18 9.91,27.18 9.28,26.56 U$23.P$5 | 10.55,30.24 12.06,31.75 JP1.5 | 10.55,28.69 v10.67,28.57 | 24.55,19.9 JP9.1 | JP10.3 25.4,50.16 24.35,49.11 | v19.94,33.15 19.94,41.15 19.16,41.92
  other vias: 7.37,51.82 8.89,61.09 12.88,34.54 6.93,43.51 11.43,49.15 10.03,46.61 5.84,38.48 12.7,18.41 2.54,5.08 10.16,9.4 1.24,15.98 21.11,55.5 3.43,56.01 9.02,58.17 35.56,50.8
  pour Top (isolate 0.305): 15.24,25.4 0,25.4 0,0 15.24,0
  pour Bottom (isolate 0.305): 15.24,25.4 0,25.4 0,0 15.24,0
  pour Top (isolate 0.305): 0,30.48 0,63.5 17.78,63.5 17.78,30.48
  pour Bottom (isolate 0.305): 0,30.48 0,63.5 17.78,63.5 17.78,30.48
  pour Top (isolate 0.305): 24.13,52.07 24.13,44.45 39.37,44.45 39.37,52.07
  pour Bottom (isolate 0.305): 24.13,52.07 24.13,44.45 39.37,44.45 39.37,52.07
  pour Bottom (isolate 0.305): 24.13,63.5 24.13,55.88 39.37,55.88 39.37,63.5
  pour Top (isolate 0.305): 24.13,63.5 24.13,55.88 39.37,55.88 39.37,63.5
  pour Top (isolate 0.305): 24.13,40.64 24.13,30.48 39.37,30.48 39.37,40.64
  pour Bottom (isolate 0.305): 24.13,26.67 24.13,13.97 39.37,13.97 39.37,26.67
  pour Top (isolate 0.305): 24.13,26.67 24.13,13.97 39.37,13.97 39.37,26.67
  pour Bottom (isolate 0.305): 24.13,40.64 24.13,30.48 39.37,30.48 39.37,40.64
  pour Top (isolate 0.305): 0,63.5 0,0 39.37,0 39.37,63.5
  pour Bottom (isolate 0.305): 0,63.5 0,0 39.37,0 39.37,63.5
MISO  (via drill 0.51)
  Top 0.254: U1.16 11.15,55.75 v11.3,55.75
  Bottom 0.254: v11.3,55.75 11.3,57.91 9.91,59.31 3.43,59.31 JP6.10
MOSI  (via drill 0.51)
  Top 0.254: v12.57,56.01 12.57,55.75 11.56,54.74 11.27,54.74 U1.15
  Bottom 0.254: JP6.11 1.4,59.82 10.29,59.82 12.57,57.53 v12.57,56.01
N1  (via drill 1.02 pad 1.88)
  Top 1.016: v20.32,1.27 v22.86,1.27 v25.4,1.27 v27.94,1.27 v30.48,1.27 v33.02,1.27 v35.56,1.27 v38.1,1.27
  Bottom 1.016: 17.78,1.27 v38.1,1.27
N2  (via drill 1.02 pad 1.88)
  Top 1.016: v20.32,3.81 v22.86,3.81 v25.4,3.81 v27.94,3.81 v30.48,3.81 v33.02,3.81 v35.56,3.81 v38.1,3.81
  Bottom 1.016: 17.78,3.81 v38.1,3.81
N3  (via drill 1.02 pad 1.88)
  Top 1.016: v17.78,1.27 20.32,1.27
N4  (via drill 1.02 pad 1.88)
  Top 1.016: v17.78,3.81 20.32,3.81
N$1
  Top 0.254: U1.8 14.99,47.39 14.99,45.72 15.24,45.47 15.24,43.3 14.75,42.8
N$2
  Top 0.254: U1.7 13.89,47.35 13.89,45.36 Q1.3
N$3
  Top 0.254: LED2.A R1.1
N$4
  Top 0.254: R3.1 LED3.A
N$5
  Bottom 0.254: 7.37,7.62 8.26,7.62
N$6
  Top 0.254: LED4.R 32.32,33.3 R4.2
N$7
  Top 0.254: D3.A R6.2
N$8
  Top 0.254: LED4.B 34.19,37.06 34.8,36.45 35.52,36.45 R5.2
N$9
  Top 0.254: LED4.G 32.32,37.4 33.87,38.95 R7.2
N$10  (via drill 1.02 pad 1.88)
  other vias: 38.1,8.89
N$11  (via drill 1.02 pad 1.88)
  other vias: 35.56,8.89
N$12  (via drill 1.02 pad 1.88)
  other vias: 33.02,8.89
N$13  (via drill 1.02 pad 1.88)
  other vias: 30.48,8.89
N$14  (via drill 1.02 pad 1.88)
  other vias: 27.94,8.89
N$15  (via drill 1.02 pad 1.88)
  other vias: 25.4,8.89
N$16  (via drill 1.02 pad 1.88)
  other vias: 22.86,8.89
N$17  (via drill 1.02 pad 1.88)
  other vias: 20.32,8.89
N$18  (via drill 1.02 pad 1.88)
  other vias: 17.78,8.89
N$19  (via drill 1.02 pad 1.88)
  other vias: 20.32,13.97
N$20  (via drill 1.02 pad 1.88)
  other vias: 17.78,13.97
N$21  (via drill 1.02 pad 1.88)
  other vias: 20.32,11.43
N$22  (via drill 1.02 pad 1.88)
  other vias: 17.78,19.05
N$23  (via drill 1.02 pad 1.88)
  other vias: 17.78,16.51
N$24  (via drill 1.02 pad 1.88)
  other vias: 17.78,24.13
N$25  (via drill 1.02 pad 1.88)
  other vias: 17.78,21.59
N$27  (via drill 1.02 pad 1.88)
  other vias: 38.1,6.35
N$28  (via drill 1.02 pad 1.88)
  other vias: 35.56,6.35
N$29  (via drill 1.02 pad 1.88)
  other vias: 33.02,6.35
N$30  (via drill 1.02 pad 1.88)
  other vias: 30.48,6.35
N$31  (via drill 1.02 pad 1.88)
  other vias: 27.94,6.35
N$32  (via drill 1.02 pad 1.88)
  other vias: 25.4,6.35
N$33  (via drill 1.02 pad 1.88)
  other vias: 22.86,6.35
N$34  (via drill 1.02 pad 1.88)
  other vias: 20.32,6.35
N$38
  Top 0.254: R11.1 8.04,37.12 9.14,38.23 9.14,40.89 9.49,41.24 LED1.A
NET1  (via drill 1.02 pad 1.88)
  other vias: 17.78,6.35
NET2  (via drill 1.02 pad 1.88)
  other vias: 17.78,11.43
RAW  (via drill 0.51)
  Top 0.254: U2.1 8.45,40.32 8.64,40.13 8.64,38.73 8.32,38.42 U2.3 6.82,38.42 6.68,38.28 v6.68,37.39 6.32,37.03 C19.A
  Bottom 0.254: JP6.1 2.95,35.97 5.26,35.97 v6.68,37.39
RESET  (via drill 0.51)
  Top 0.203: 3.3,41.78 4.83,41.78 5.46,42.42
  Top 0.254: v6.73,48.26 6.73,46.8 U1.29 | 2.54,39.37 2.54,34.92 3.12,34.34 C2.1 | 2.54,39.37 JP6.3 | 5.46,42.42 5.46,45.53 U1.29 | 2.54,39.37 2.54,41.02 3.3,41.78 | U1.29 | U1.29 | R2.1 13.2,60.45 12.06,60.45 11.68,60.07 S1.4 11.33,58.29 v8.79,55.75 8.79,56.62 7.11,58.29 S1.3
  Bottom 0.254: JP7.10 13.21,42.67 6.35,42.67 6.1,42.93 6.1,47.62 v6.73,48.26 6.73,49.45 8.79,51.51 v8.79,55.75
RX-I
  Top 0.254: JP7.12 15.24,33.02 6.71,33.02 | 6.71,33.02 6.71,35.1 6.53,35.28 4.06,35.28 3.1,36.25 3.1,40.89 3.56,41.35 5.16,41.35 5.97,42.16 5.97,43.78 U1.31 | U3.5 2.82,16.86 2.41,17.27 2.41,22.73 JP3.5 | 6.71,33.02 6.35,33.02 JP1.2 | U1.31
  Bottom 0.203: JP3.5 4.45,24.13 5.93,25.62 U$23.P$1 5.93,27.52 7.2,28.79 U$22.P$1 7.2,30.26 5.71,31.75 JP1.2
RXLED
  Top 0.254: U3.22 12.38,15.56 13.65,14.29 14.05,14.29 LED3.C
SCK  (via drill 0.51)
  Top 0.254: U1.17 6.83,55.55 v6.81,55.55 | R6.1 4.14,57.48 2.74,57.48 2.54,57.28 2.54,56.52 1.27,55.24 JP6.9
  Bottom 0.254: v6.81,55.55 4.34,53.09 2.29,53.09 1.27,54.1 JP6.9
TX-O  (via drill 0.51)
  Top 0.254: v5.59,49.53 6.73,49.53 7.62,48.64 7.62,47.5 7.37,47.24 7.37,46.31 U1.30 | JP3.4 2.92,20.7 2.92,19.63 3.09,19.46 U3.1 | v7.62,34.04 8.08,33.58 13.26,33.58 JP7.11
  Bottom 0.203: JP1.3 7.62,30.86 8.04,30.44 U$22.P$2 8.04,28.36 6.77,27.09 U$23.P$2 6.77,24.55 JP3.4
  Bottom 0.254: v5.59,49.53 5.59,42.55 5.97,42.16 11.18,42.16 JP7.11 | JP1.3 v7.62,34.04
TXLED
  Top 0.254: U3.23 12.99,16.21 13.65,15.56 14.15,15.56 LED2.C
USB_D+
  Top 0.254: U3.15 8.47,11.02 7.62,10.16 X2.D+
USB_D-
  Top 0.254: U3.16 7.86,11.66 6.82,10.63 X2.D-
VCC  (via drill 0.51)
  Top 0.203: v15.24,28.07 20.45,28.07 21.97,29.59 v21.97,32.65 v21.97,44.2 21.97,58.57 v21.36,59.18
  Top 0.254: 11.18,37.97 12.7,37.97 13.08,37.59 C13.A | 8.89,53.34 8.89,54.61 11.18,56.9 12.45,56.9 13.28,57.73 R2.2 | U2.5 10.79,40.32 11.18,39.94 11.18,37.97 | v11.18,34.44 11.18,36.83 | 11.18,36.83 11.18,37.97 | 11.18,36.83 v11.12,36.83 9.87,36.83 R11.2 | 10.54,49.53 10.54,49.91 10.92,50.29 11.81,50.29 12.32,49.78 12.32,47.8 U1.6 | 10.54,49.53 9.65,49.53 8.89,50.29 8.89,53.34 | 10.54,49.53 10.54,47.31 U1.4 | U3.4 5.07,17.52 5.71,18.16 5.71,20.95 JP3.3 | LED4.A 35.56,32.22 v35.56,31.75 | U1.4 12.19,45.66 12.19,45.39 11.25,44.45 C10.1 11.12,43.37 10.36,42.61 10.36,41.02 10.19,40.85 U2.5 | U1.4 | C3.2 5.46,55.5 6.35,54.61 6.64,54.61 U1.18 7.91,53.34 8.89,53.34 | 10.19,40.72 U2.5 | JP21.2 26.23,59.69 R9.2 | JP10.1 34.42,45.72 35.18,46.48 35.18,47.75 34.67,48.26 U5.C
  Bottom 0.203: 8.88,24.14 JP3.3 8.45,24.57 U$23.P$4 8.45,26.53 9.6,27.69 9.72,27.69 | 10.15,31.74 JP1.4 10.16,30.86 9.72,30.42 U$22.P$4 9.72,27.69 | JP8.4 25.4,32.38 24.13,33.66 24.13,34.16 23.99,34.3 U$8.P$1 22.11,34.3 21.97,34.16 v21.97,32.65 | JP10.1 25.4,46.35 24.35,47.41 U$9.P$1 22.64,47.41 21.97,46.74 v21.97,44.2 | 9.72,27.69 13.72,27.69 14.1,28.07 v15.24,28.07 | v21.36,59.18 21.89,59.72 U$2.P$2 25.38,59.72 JP21.2
  Bottom 0.254: JP6.4 2.54,41.91 3.12,41.33 8.46,41.33 11.12,38.66 v11.12,36.83 | JP1.4 10.16,33.27 11.18,34.29 v11.18,34.44 | SJ2.2 7.37,8.64 8.89,10.16 JP3.3 | JP8.4 v35.56,31.75

### Text on the board
Top: Route Out | Route Out | Route Out | Route Out | Route Out | Route Out | Route Out | Route Out | Route Out | Route Out | Route Out | Route Out | Route Out | Route Out | Route Out | Route Out | Route Out | Route Out | Route Out
Bottom: V15
tPlace: 10 | 9 | 7 | 11 | 8 | VCC | 12 | 7 | Reset | GND | Button | 13 | 6 | A0 | 5 | A1 | 4 | GND | A2 | A0 | 3 | Light | A3 | 2 | VCC | Sensor | VCC | GND | RST | RST | 5-G | GND | RXI | ProtoSnap | Pro Mini | 6-B | RAW | TXO | TXO | RXI | VCC | GND | 3-R | GRN | BLK | VCC | RGB LED | 2 | DTR | RXI | TXO | VCC | CTS | GND | GRN | BLK | TX | Buzzer | GND | RX | 5V | FTDI Basic
bPlace: Uno Compatible | SIG | 5V | 3.3V | 20MHz | 16MHz | 10MHz | 8MHz | VCC | GND | GND | SIG | A4 | VCC | A5 | GRN | Pro Mini | BLU | RED | VCC | 3.3V | 5V
tDocu: Jim Lindblom | Revised by Pete Lewis